# EAGLE schematic grid-rfduino_v3 (EAGLE 6.5.0)
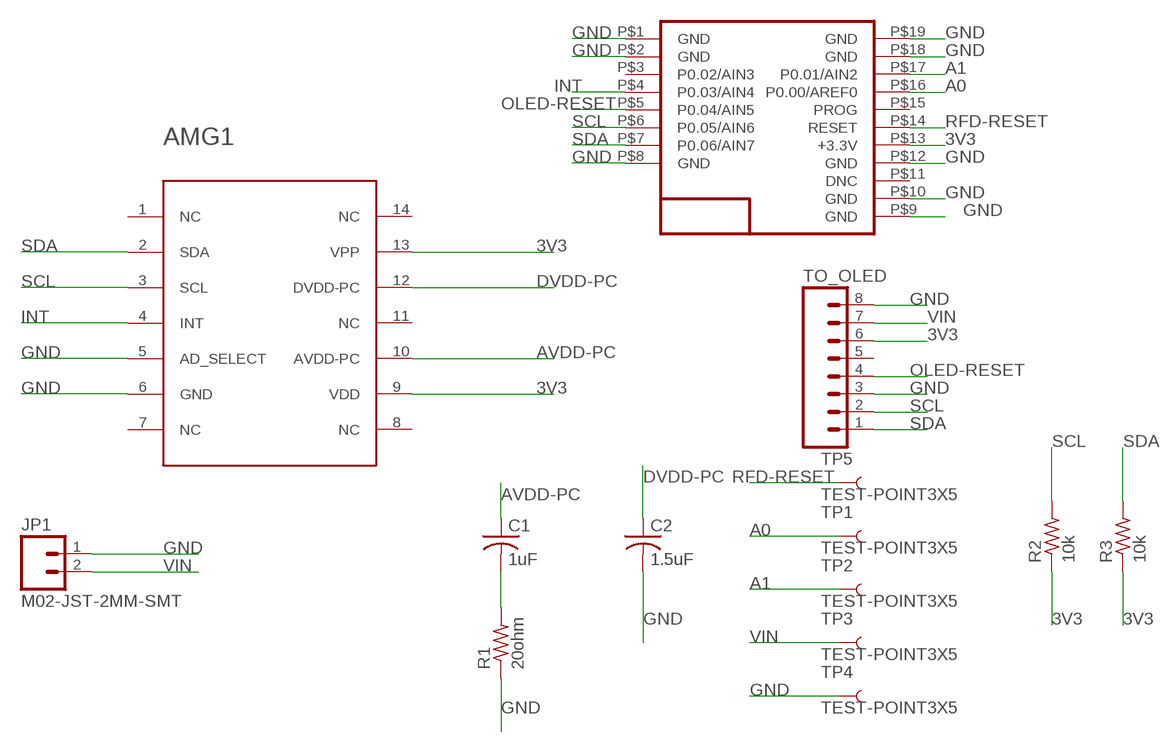
[diagram p0: schematic, sheet 1]

## Parts
AMG1  AMG8831  [AMG8831]
C1  1uF  C-USC0805  [C0805]
C2  1.5uF  C-USC0805  [C0805]
JP1  M02-JST-2MM-SMT  [JST-2-SMD]
R1  20ohm  R-US_M0805  [M0805]
R2  10k  R-US_M0805  [M0805]
R3  10k  R-US_M0805  [M0805]
TO_OLED  M08LOCK  [1X08_LOCK]
TP1  TEST-POINT3X5  [PAD.03X.05]
TP2  TEST-POINT3X5  [PAD.03X.05]
TP3  TEST-POINT3X5  [PAD.03X.05]
TP4  TEST-POINT3X5  [PAD.03X.05]
TP5  TEST-POINT3X5  [PAD.03X.05]
U$1  RFD22301  [RFD21733]

## Nets
3V3: AMG1.9(VDD) AMG1.13(VPP) R2.1 R3.1 TO_OLED.6 U$1.P$13(+3.3V)
A0: TP1.P$1 U$1.P$16(P0.00/AREF0)
A1: TP2.P$1 U$1.P$17(P0.01/AIN2)
AVDD-PC: AMG1.10(AVDD-PC) C1.1
DVDD-PC: AMG1.12(DVDD-PC) C2.1
GND: AMG1.5(AD_SELECT) AMG1.6(GND) C2.2 JP1.1 R1.1 TO_OLED.3 TO_OLED.8 TP4.P$1 U$1.P$1(GND) U$1.P$2(GND) U$1.P$8(GND) U$1.P$9(GND) U$1.P$10(GND) U$1.P$12(GND) U$1.P$18(GND) U$1.P$19(GND)
INT: AMG1.4(INT) U$1.P$4(P0.03/AIN4)
N$1: C1.2 R1.2
OLED-RESET: TO_OLED.4 U$1.P$5(P0.04/AIN5)
RFD-RESET: TP5.P$1 U$1.P$14(RESET)
SCL: AMG1.3(SCL) R2.2 TO_OLED.2 U$1.P$6(P0.05/AIN6)
SDA: AMG1.2(SDA) R3.2 TO_OLED.1 U$1.P$7(P0.06/AIN7)
VIN: JP1.2 TO_OLED.7 TP3.P$1
Unconnected: AMG1.1(NC) AMG1.7(NC) AMG1.8(NC) AMG1.11(NC) AMG1.14(NC) TO_OLED.5 U$1.P$3(P0.02/AIN3) U$1.P$11(DNC) U$1.P$15(PROG)

## Library data of the parts
AMG1 = AKA_test:AMG8831: Infrared Array Sensor Grid-EYE (AMG88) High Precision Infrared Array Sensor based on Advanced MEMS Technology I2C interface This outline is good for all models AMG88-x-y x = 3 or 5, indicating supply voltage y = 1 or 2; 1 is high-gain, 2 is low-gain See the datasheet from Panasonic here <http://pewa.panasonic.com/assets/pcsd/catalog/grid-eye-catalog.pdf>
C1 C2 = adafruit:C-US: CAPACITOR, American symbol
JP1 = SparkFun-Connectors:M02: Standard 2-pin 0.1" header. Use with - straight break away headers ( PRT-00116) - right angle break away headers (PRT-00553) - swiss pins (PRT-00743) - machine pins (PRT-00117) - female headers (PRT-00115) Molex polarized connector foot print use with: PRT-08233 with associated crimp pins and housings. 2.54_SCREWTERM for use with PRT-10571. 3.5mm Screw Terminal footprints for PRT-08084 5mm Screw Terminal footprints for use with PRT-08433; PROD_ID: CONN-08352
R1-R3 = adafruit:R-US_: RESISTOR, American symbol
TO_OLED = SparkFun-Connectors:M08: Header 8 Standard 8-pin 0.1" header. Use with straight break away headers (SKU : PRT-00116), right angle break away headers (PRT-00553), swiss pins (PRT-00743), machine pins (PRT-00117), and female headers (PRT-00115).
TP1-TP5 = SparkFun-Passives:TEST-POINT: Bare copper test points for troubleshooting or ICT
U$1 = RFD22301-11.25.13:RFD22301: RF Digital RFD22301